# Altium schematic sheet SME_tps61022.SchDoc: Titulo
size OrCAD A; Author: Ismael Poblete V.; CompanyName: SME; Organization: SME; Address1: Santiago, Chile; DocumentNumber: SME-UNO; Revision: 1.0; SheetNumber: 5; SheetTotal: 7
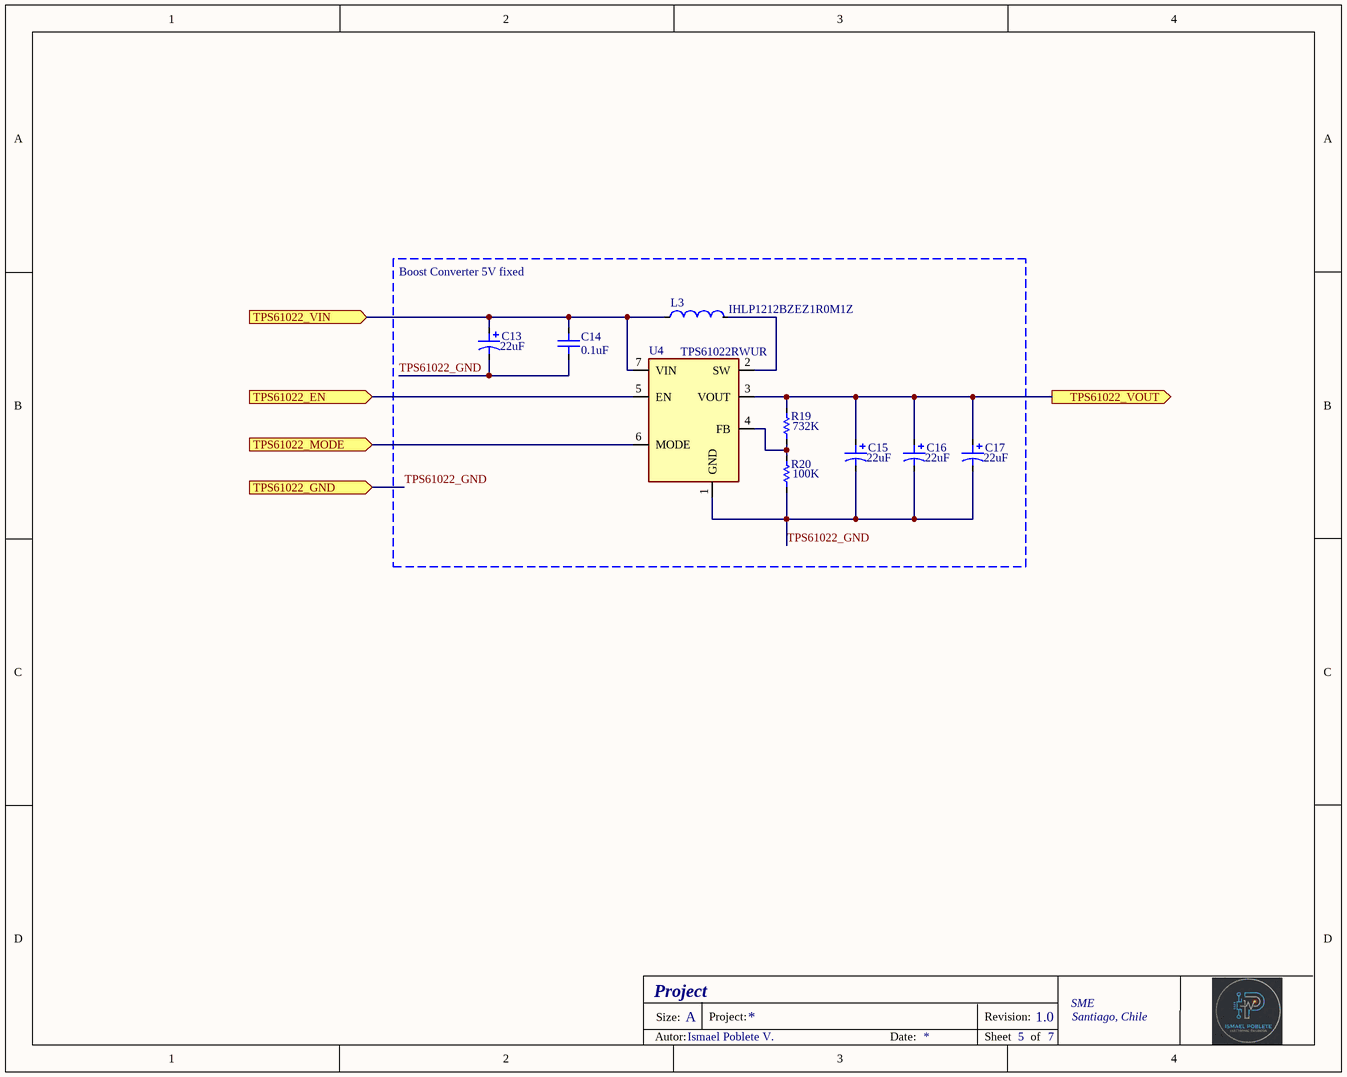
[diagram p0: SME_tps61022.SchDoc]

## Parts
C13  Capacitance: 22uF  [T491B / CASE_B]  (hidden comment: T491B226K006AT)
C14  Capacitance: 0.1uF  [C0603]  (hidden comment: CC0603KRX7R9BB104)
C15  Capacitance: 22uF  [T491B / CASE_B]  (hidden comment: T491B226K006AT)
C16  Capacitance: 22uF  [T491B / CASE_B]  (hidden comment: T491B226K006AT)
C17  Capacitance: 22uF  [T491B / CASE_B]  (hidden comment: T491B226K006AT)
L3  IHLP1212BZEZ1R0M1Z  [INDPM3030X200N]
R19  Resistance: 732K  [RES_0805]  (hidden comment: RT0805BRD07732KL)
R20  Resistance: 100K  [RES_0603]  (hidden comment: RT0603FRD07100KL)
U4  TPS61022RWUR  [7-Pin VQFN w thermal]

## Blocks framed on the sheet
Boost Converter 5V fixed: C13-C17 L3 R19 R20 U4

## Ports
TPS61022_EN (in, see SME_Main[3C]), TPS61022_GND (in, see SME_Main[4C]), TPS61022_MODE (in, see SME_Main[3C]), TPS61022_VIN (in, see SME_Main[3C]), TPS61022_VOUT (out, see SME_Main[4C])

## Nets
TPS61022_EN: U4.5(EN) ; port TPS61022_EN
TPS61022_GND: C13.2 C14.1 C15.2 C16.2 C17.2 R20.1 U4.1(GND) ; port TPS61022_GND
TPS61022_MODE: U4.6(MODE) ; port TPS61022_MODE
TPS61022_VIN: C13.1 C14.2 L3.1 U4.7(VIN) ; port TPS61022_VIN
TPS61022_VOUT: C15.1 C16.1 C17.1 R19.2 U4.3(VOUT) ; port TPS61022_VOUT
NetL3_2: L3.2 U4.2(SW)
NetR19_1: R19.1 R20.2 U4.4(FB)

## Notes on the sheet
- Project
- Size:
- A
- Project:
- Revision:
- Autor:
- Date:
- Sheet
- of

## Library data of the parts
C13 C15-C17 = T491B226K006AT: Tantalum Capacitors - Solid SMD 6.3V 22uF 1311 10% ESR=3.5ohms
C14 = CC0603KRX7R9BB104: Multilayer Ceramic Capacitors MLCC - SMD/SMT 50 V 0.1uF X7R 0603 10%
L3 = IHLP1212BZEZ1R0M1Z: 1 H Shielded Molded Inductor 8.4 A 20mOhm Max 1212 (3030 Metric); Manufacturer_Name: Vishay; Geometry.Height: 2mm; Mouser Part Number: *; Mouser Price/Stock: *; Manufacturer_Part_Number: IHLP1212BZEZ1R0M1Z; Datasheet Link: https://www.vishay.com/docs/34671/ihlp1212-ez-1z.pdf
R19 = RT0805BRD07732KL: Thin Film Resistors - SMD 732 kOhms 25PPM/C 125mW 0805 10%; Case/Package: 0805
R20 = RT0603FRD07100KL: Thin Film Resistors - SMD 100K OHM 1% 25PPM 1/10W; Case/Package: 0603
U4 = TPS61022RWUR: 8-A boost converter with 0.5-V ultra-low input voltage; Manufacturer_Name: Texas Instruments; Geometry.Height: 1mm; Mouser Part Number: 595-TPS61022RWUR; Mouser Price/Stock: https://www.mouser.co.uk/ProductDetail/Texas-Instruments/TPS61022RWUR?qs=vLWxofP3U2zlxrk4cD0iFA%3D%3D; Manufacturer_Part_Number: TPS61022RWUR; Datasheet Link: http://www.ti.com/lit/gpn/TPS61022